# EAGLE design gal_pla_smd_ii (EAGLE 9.6.1)
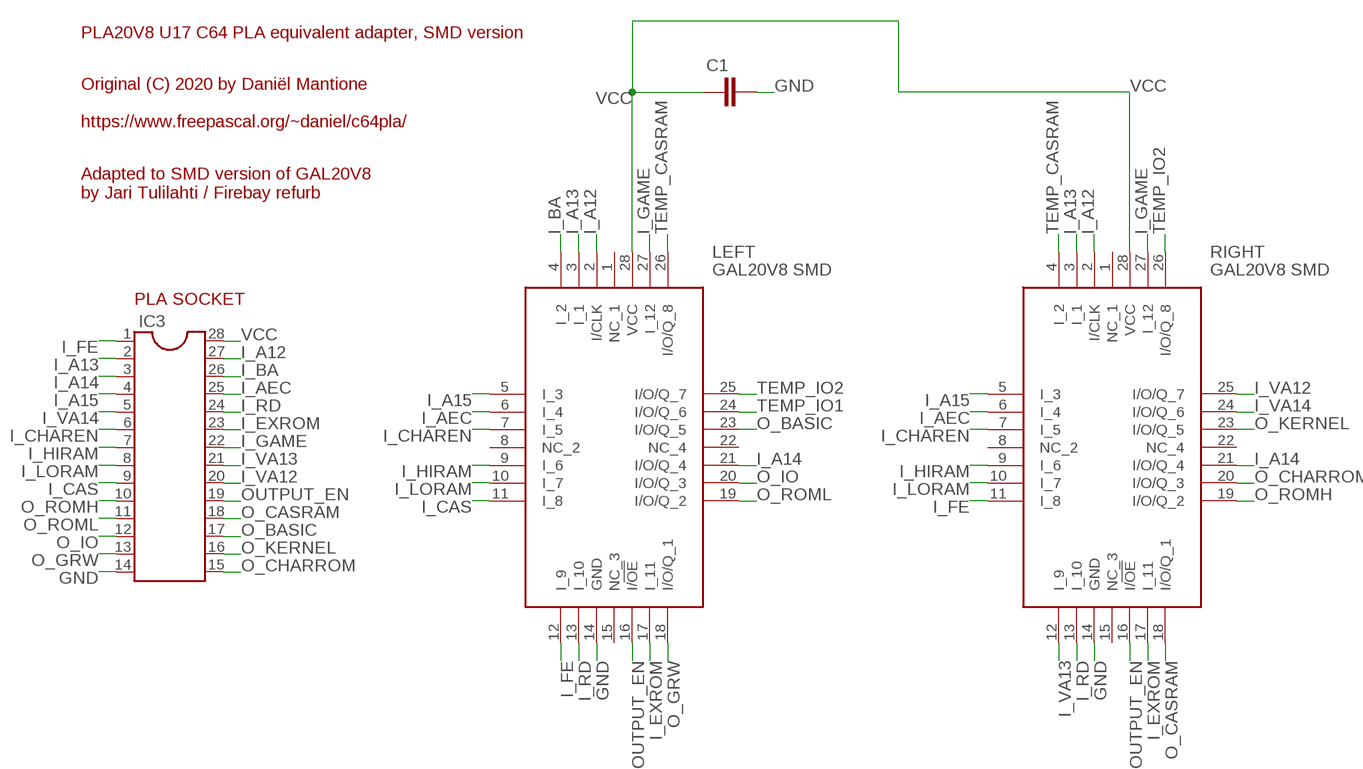
[diagram p0: schematic, sheet 1]

## Parts
C1  CAP0603-CAP  [0603-CAP]
IC3  DIL28  [DIL28-6]
LEFT  GAL20V8 SMD  GAL20V8B-10LJI  [PLCC127P1245X1245X457-28N]
RIGHT  GAL20V8 SMD  GAL20V8B-10LJI  [PLCC127P1245X1245X457-28N]

## Nets
GND: C1.2 IC3.14 LEFT.14(GND) RIGHT.14(GND)
I_A12: IC3.27 LEFT.2(I/CLK) RIGHT.2(I/CLK)
I_A13: IC3.2 LEFT.3(I_1) RIGHT.3(I_1)
I_A14: IC3.3 LEFT.21(I/O/Q_4) RIGHT.21(I/O/Q_4)
I_A15: IC3.4 LEFT.5(I_3) RIGHT.5(I_3)
I_AEC: IC3.25 LEFT.6(I_4) RIGHT.6(I_4)
I_BA: IC3.26 LEFT.4(I_2)
I_CAS: IC3.9 LEFT.11(I_8)
I_CHAREN: IC3.6 LEFT.7(I_5) RIGHT.7(I_5)
I_EXROM: IC3.23 LEFT.17(I_11) RIGHT.17(I_11)
I_FE: IC3.1 LEFT.12(I_9) RIGHT.11(I_8)
I_GAME: IC3.22 LEFT.27(I_12) RIGHT.27(I_12)
I_HIRAM: IC3.7 LEFT.9(I_6) RIGHT.9(I_6)
I_LORAM: IC3.8 LEFT.10(I_7) RIGHT.10(I_7)
I_RD: IC3.24 LEFT.13(I_10) RIGHT.13(I_10)
I_VA12: IC3.20 RIGHT.25(I/O/Q_7)
I_VA13: IC3.21 RIGHT.12(I_9)
I_VA14: IC3.5 RIGHT.24(I/O/Q_6)
O_BASIC: IC3.17 LEFT.23(I/O/Q_5)
O_CASRAM: IC3.18 RIGHT.18(I/O/Q_1)
O_CHARROM: IC3.15 RIGHT.20(I/O/Q_3)
O_GRW: IC3.13 LEFT.18(I/O/Q_1)
O_IO: IC3.12 LEFT.20(I/O/Q_3)
O_KERNEL: IC3.16 RIGHT.23(I/O/Q_5)
O_ROMH: IC3.10 RIGHT.19(I/O/Q_2)
O_ROML: IC3.11 LEFT.19(I/O/Q_2)
OUTPUT_EN: IC3.19 LEFT.16(I/!OE) RIGHT.16(I/!OE)
TEMP_CASRAM: LEFT.26(I/O/Q_8) RIGHT.4(I_2)
TEMP_IO1: LEFT.24(I/O/Q_6)
TEMP_IO2: LEFT.25(I/O/Q_7) RIGHT.26(I/O/Q_8)
VCC: C1.1 IC3.28 LEFT.28(VCC) RIGHT.28(VCC)
Unconnected: LEFT.1(NC_1) LEFT.8(NC_2) LEFT.15(NC_3) LEFT.22(NC_4) RIGHT.1(NC_1) RIGHT.8(NC_2) RIGHT.15(NC_3) RIGHT.22(NC_4)

## Notes on the sheet
- PLA20V8 U17 C64 PLA equivalent adapter, SMD version
- Original (C) 2020 by Daniël Mantione
  
  https://www.freepascal.org/~daniel/c64pla/
- Adapted to SMD version of GAL20V8
  by Jari Tulilahti / Firebay refurb
- PLA SOCKET

## Library data of the parts
C1 = SparkFun-Passives:CAP: Capacitor Standard 0603 ceramic capacitor, and 0.1" leaded capacitor.
IC3 = ic-package:DIL28: Dual In Line
LEFT RIGHT = rakettitiede:GAL20V8B-10LJI: SPLD - Simple Programmable Logic Devices Source: Datasheet <https://www.alldatasheet.com/datasheet-pdf/pdf/70207/LATTICE/GAL20V8B-10LJI.html>; DESCRIPTION: SPLD - Simple Programmable Logic Devices; HEIGHT: 4.572mm; MANUFACTURER_NAME: Lattice Semiconductor; MANUFACTURER_PART_NUMBER: GAL20V8B-10LJI; MOUSER_PART_NUMBER: N/A; MOUSER_PRICE-STOCK: https://www.mouser.co.uk/ProductDetail/Lattice/GAL20V8B-10LJI?qs=Z6FgPJT5dDT7MYT0iLf8iA%3D%3D

## Board
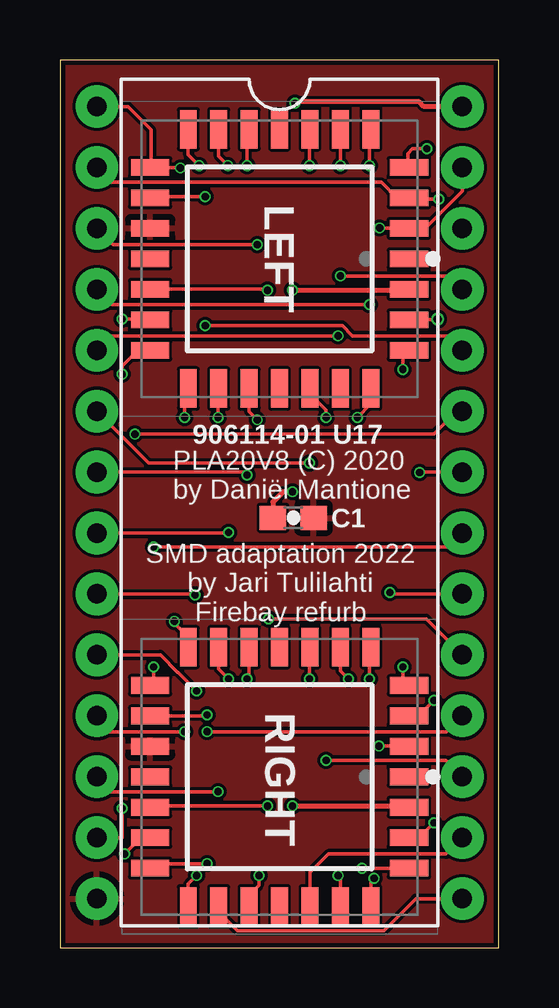
[diagram p1: board, top side]
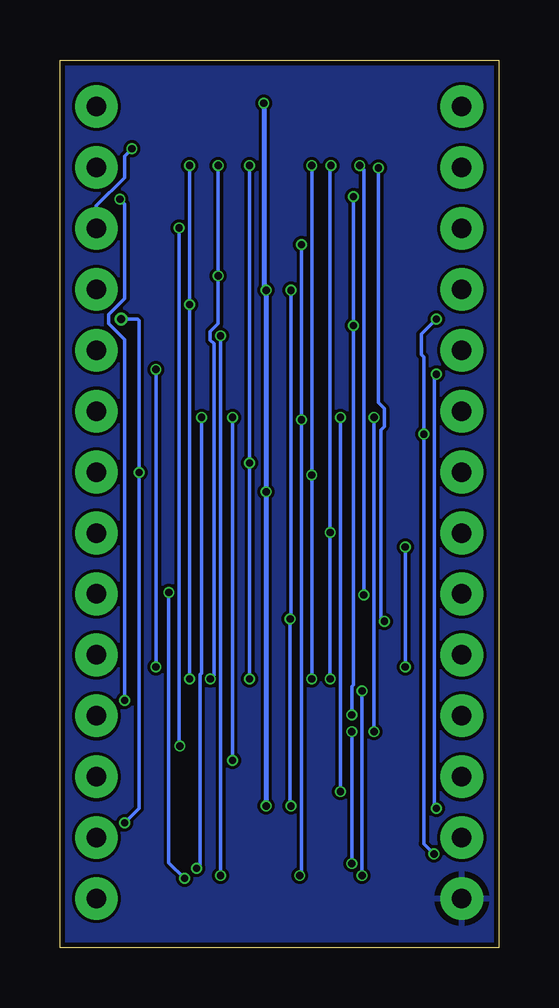
[diagram p2: board, bottom side, seen from below]

Size 18.3 x 37 mm. Coordinates in mm from the lower left corner, seen from the top.
Outline: 0,0 18.3,0 18.3,37 0,37 0,0
Copper layers (1*16): Top 0.035559375mm / dielectric 1.6mm / Bottom 0.035559375mm
Design rules "jlcpcb-2-layer": minimum track width 5mil, minimum drill 0.3mm, track to track 5mil, track to pad 5mil, pad to pad 5mil, via to via 5mil, smd to smd 5mil, copper to edge 8mil, drill to drill 6mil, minimum pad ring 5mil, minimum via ring 3mil, stop-mask expansion 2.5mil, vias tented up to drill 20mil, thermal gap 10mil

### Footprints (pad centres in the part's own frame; a part is rotated, then mirrored left to right if it is on the bottom)
0603-CAP = smd 1.1 x 1: 1 -0.85,0; 2 0.85,0
DIL28-6 = drill 0.813 pad 1.778: 1 -16.51,-7.62; 2 -13.97,-7.62; 3 -11.43,-7.62; 4 -8.89,-7.62; 5 -6.35,-7.62; 6 -3.81,-7.62; 7 -1.27,-7.62; 8 1.27,-7.62; 9 3.81,-7.62; 10 6.35,-7.62; 11 8.89,-7.62; 12 11.43,-7.62; 13 13.97,-7.62; 14 16.51,-7.62; 15 16.51,7.62; 16 13.97,7.62; 17 11.43,7.62; 18 8.89,7.62; 19 6.35,7.62; 20 3.81,7.62; 21 1.27,7.62; 22 -1.27,7.62; 23 -3.81,7.62; 24 -6.35,7.62; 25 -8.89,7.62; 26 -11.43,7.62; 27 -13.97,7.62; 28 -16.51,7.62
PLCC127P1245X1245X457-28N = smd 0.7 x 1.6: 1 0,5.4; 2 -1.27,5.4; 3 -2.54,5.4; 4 -3.81,5.4; 12 -3.81,-5.4; 13 -2.54,-5.4; 14 -1.27,-5.4; 15 0,-5.4; 16 1.27,-5.4; 17 2.54,-5.4; 18 3.81,-5.4; 26 3.81,5.4; 27 2.54,5.4; 28 1.27,5.4 | smd 1.6 x 0.7: 5 -5.4,3.81; 6 -5.4,2.54; 7 -5.4,1.27; 8 -5.4,0; 9 -5.4,-1.27; 10 -5.4,-2.54; 11 -5.4,-3.81; 19 5.4,-3.81; 20 5.4,-2.54; 21 5.4,-1.27; 22 5.4,0; 23 5.4,1.27; 24 5.4,2.54; 25 5.4,3.81

### Placement (x,y rotation side)
C1  9.73,17.91 0 top
IC3  9.16,18.55 270 top
LEFT  9.16,28.71 270 top
RIGHT  9.16,7.12 270 top

### Tracks (layer width: path | path; a pad name or v marks a point on that pad's centre or on a via)
GND
  pour Top: -1,-0.5 -1,38.87 20.59,38.87 20.59,-0.5
  pour Bottom: -0.95,38.85 20.05,38.85 20.05,-0.1 -0.95,-0.1
I_A12  (via drill 0.3)
  Top 0.152: IC3.27 16.78,31.52 15.23,29.98 LEFT.2 13.35,29.98 v13.33,30 | v13.3,8.4 14.41,8.4 RIGHT.2
  Bottom 0.152: v13.33,30 13.33,8.43 v13.3,8.4
I_A13  (via drill 0.3)
  Top 0.152: IC3.2 2.16,31.9 13.4,31.9 14.05,31.25 LEFT.3 14.47,31.2 v15.8,31.2 | v15.6,10.3 14.96,9.66 RIGHT.3
  Bottom 0.152: v15.8,31.2 15.6,31 15.6,27.06 16.27,26.39 16.27,26.01 15.6,25.34 v15.6,10.3
I_A14  (via drill 0.3)
  Top 0.152: IC3.3 2.22,29.3 v8.23,29.3 | v8.23,22 7.89,22.34 LEFT.21 | v8.3,3 8.3,2.6 7.89,2.19 RIGHT.21
  Bottom 0.152: v8.23,29.3 v8.23,22 8.23,3.07 v8.3,3
I_A15  (via drill 0.3)
  Top 0.152: IC3.4 2.18,26.8 v12.9,26.8 | v12.9,32.6 12.9,33.9 LEFT.5 | v12.9,11.2 12.9,12.31 RIGHT.5
  Bottom 0.152: v12.9,32.6 v12.9,26.8 v12.9,11.2
I_AEC  (via drill 0.3)
  Top 0.152: LEFT.6 v11.7,32.6 | v11.7,28 16.22,28 IC3.25 | v12.03,11.2 11.7,11.53 RIGHT.6
  Bottom 0.152: v11.7,32.6 v11.7,28 11.7,26.01 12.03,25.68 12.03,25.32 11.88,25.17 11.88,11.35 v12.03,11.2
I_BA  (via drill 0.3)
  Top 0.152: v15.3,33.3 14.7,33.3 14.5,33.1 14.5,32.58 LEFT.4
  Bottom 0.152: IC3.26 16.78,30.92 15.6,32.1 15.6,33 v15.3,33.3
I_CAS  (via drill 0.3)
  Top 0.152: IC3.9 5.59,14.74 v5.63,14.7 | v5.8,32.6 5.35,33.05 LEFT.11
  Bottom 0.152: v5.63,14.7 5.63,32.43 v5.8,32.6
I_CHAREN  (via drill 0.3)
  Top 0.152: IC3.6 3.7,20.2 v10.4,20.2 | v10.4,11.2 10.4,12.35 RIGHT.7 | v10.4,32.6 10.4,33.94 LEFT.7
  Bottom 0.152: v10.4,11.2 v10.4,20.2 v10.4,32.6
I_EXROM  (via drill 0.3)
  Top 0.152: IC3.23 16.56,22.36 15.6,21.4 v3.12,21.4 | v2.6,26.2 3.87,26.2 LEFT.17 | RIGHT.17 3.38,4.58 v2.7,3.9
  Bottom 0.152: v2.6,26.2 3.23,25.57 3.23,24.72 3.12,24.62 v3.12,21.4 3.12,4.33 v2.7,3.9
I_FE  (via drill 0.3)
  Top 0.152: IC3.1 2.84,35.06 3.8,34.1 3.8,32.56 LEFT.12 5,32.52 v5.02,32.5 | RIGHT.11 5.35,12.95 4.77,13.53 v4.77,13.6
  Bottom 0.152: v5.02,32.5 5.02,22.73 4.77,22.48 4.77,21.72 4.92,21.57 4.92,13.75 v4.77,13.6
I_GAME  (via drill 0.3, 0.35)
  Top 0.152: IC3.22 15.02,19.82 v15,19.8 | RIGHT.27 14.98,4.58 v15.6,5.2 | v15.75,26.2 15.67,26.17 LEFT.27
  Bottom 0.152: v15.6,5.2 15,5.8 v15,19.8 15,26.14 15.06,26.2 v15.75,26.2
I_HIRAM  (via drill 0.3)
  Top 0.152: IC3.7 7.68,19.82 v7.8,19.7 | v7.8,11.2 7.89,11.29 RIGHT.9 | v7.8,32.6 7.8,33.88 LEFT.9
  Bottom 0.152: v7.8,11.2 v7.8,19.7 v7.8,32.6
I_LORAM  (via drill 0.3)
  Top 0.152: IC3.8 7.01,17.28 v7.03,17.3 | v7.03,11.2 6.62,11.61 RIGHT.10 | v7,32.6 6.62,32.98 LEFT.10
  Bottom 0.152: v7.03,11.2 v7.03,17.3 7.03,32.57 v7,32.6
I_RD  (via drill 0.3)
  Top 0.152: IC3.24 16.18,25.5 12.21,25.5 11.78,25.93 v6.06,25.93 | v6.06,31.3 3.95,31.3 LEFT.13 | v6.13,9.7 6.09,9.66 RIGHT.13
  Bottom 0.152: v6.06,31.3 v6.06,25.93 6.06,10.95 6.13,10.88 v6.13,9.7
I_VA12  (via drill 0.3)
  Top 0.152: IC3.20 13.82,14.74 v13.76,14.8 | v13.1,2.88 12.97,2.75 RIGHT.25
  Bottom 0.152: v13.76,14.8 13.76,3.54 v13.1,2.88
I_VA13  (via drill 0.3)
  Top 0.152: IC3.21 16.2,16.7 v3.9,16.7 | v3.9,11.7 3.9,10.93 RIGHT.12
  Bottom 0.152: v3.9,16.7 v3.9,11.7
I_VA14  (via drill 0.3)
  Top 0.152: IC3.5 2.14,25.5 v11.6,25.5 | v11.6,3 11.7,2.9 RIGHT.24
  Bottom 0.152: v11.6,25.5 v11.6,3
O_BASIC  (via drill 0.3)
  Top 0.152: IC3.17 16.1,7.8 v11.1,7.8 | v11.1,22.1 11.1,22.4 10.43,23.07 LEFT.23
  Bottom 0.152: v11.1,7.8 v11.1,22.1
O_CASRAM  (via drill 0.3)
  Top 0.152: IC3.18 16.12,9 v6.13,9 | v6.13,3.5 4.09,3.5 RIGHT.18
  Bottom 0.152: v6.13,9 v6.13,3.5
O_CHARROM
  Top 0.152: IC3.15 14.84,2.04 13.5,0.7 7.4,0.7 6.62,1.48 RIGHT.20
O_GRW  (via drill 0.3)
  Top 0.152: IC3.13 2.6,4.58 v2.6,5.8 | v2.6,23.9 2.6,24.24 3.26,24.9 LEFT.18
  Bottom 0.152: v2.6,5.8 2.6,5.96 2.7,5.96 2.7,23.8 v2.6,23.9
O_IO  (via drill 0.3)
  Top 0.152: IC3.12 1.54,6.5 v6.6,6.5 | v6.6,22.1 6.6,23.45 LEFT.20
  Bottom 0.152: v6.6,6.5 v6.6,22.1
O_KERNEL
  Top 0.152: IC3.16 16.1,3.9 11.2,3.9 10.43,3.13 RIGHT.23
O_ROMH  (via drill 0.3)
  Top 0.152: v5.7,10.7 4.92,11.47 4.19,12.2 IC3.10 | v5.7,3 5.35,2.65 RIGHT.19
  Bottom 0.152: v5.7,10.7 v5.7,3
O_ROML  (via drill 0.3)
  Top 0.152: IC3.11 1.54,9 v5.2,9 | v5.2,22.1 5.2,23.45 LEFT.19
  Bottom 0.152: v5.2,9 v5.2,22.1
OUTPUT_EN  (via drill 0.3)
  Top 0.152: LEFT.16 8.62,27.44 v8.66,27.4 | v8.7,13.7 15.28,13.7 IC3.19 | v8.66,5.9 3.95,5.9 RIGHT.16
  Bottom 0.152: v8.66,27.4 8.66,13.54 v8.7,13.7 8.7,5.94 v8.66,5.9
TEMP_CASRAM  (via drill 0.3)
  Top 0.152: LEFT.26 14.3,24.78 v14.3,24.1 | v14.3,11.7 14.3,11.05 RIGHT.4
  Bottom 0.152: v14.3,24.1 v14.3,11.7
TEMP_IO2  (via drill 0.3)
  Top 0.152: RIGHT.26 v12.61,3.31 v12.6,3.3 | v12.4,22.1 12.97,22.67 LEFT.25
  Bottom 0.152: v12.4,22.1 12.4,11.44 12.46,11.38 12.46,3.44 v12.6,3.3
VCC  (via drill 0.3)
  Top 0.203: IC3.28 15.18,35.06 14.98,35.26 9.86,35.26 v9.8,35.2 | v9.7,27.4 14.38,27.4 LEFT.28 | v9.7,19 9.3,19 8.88,18.58 C1.1 | v9.7,5.9 14.37,5.9 RIGHT.28
  Bottom 0.203: v9.8,35.2 9.8,27.5 v9.7,27.4 v9.7,19 v9.7,5.9

### Text on the board
tPlace: 906114-01 U17 | PLA20V8 (C) 2020 / by Daniël Mantione | SMD adaptation 2022 / by Jari Tulilahti / Firebay refurb